# EAGLE schematic dev_kit_f103 (EAGLE 9.6.2)
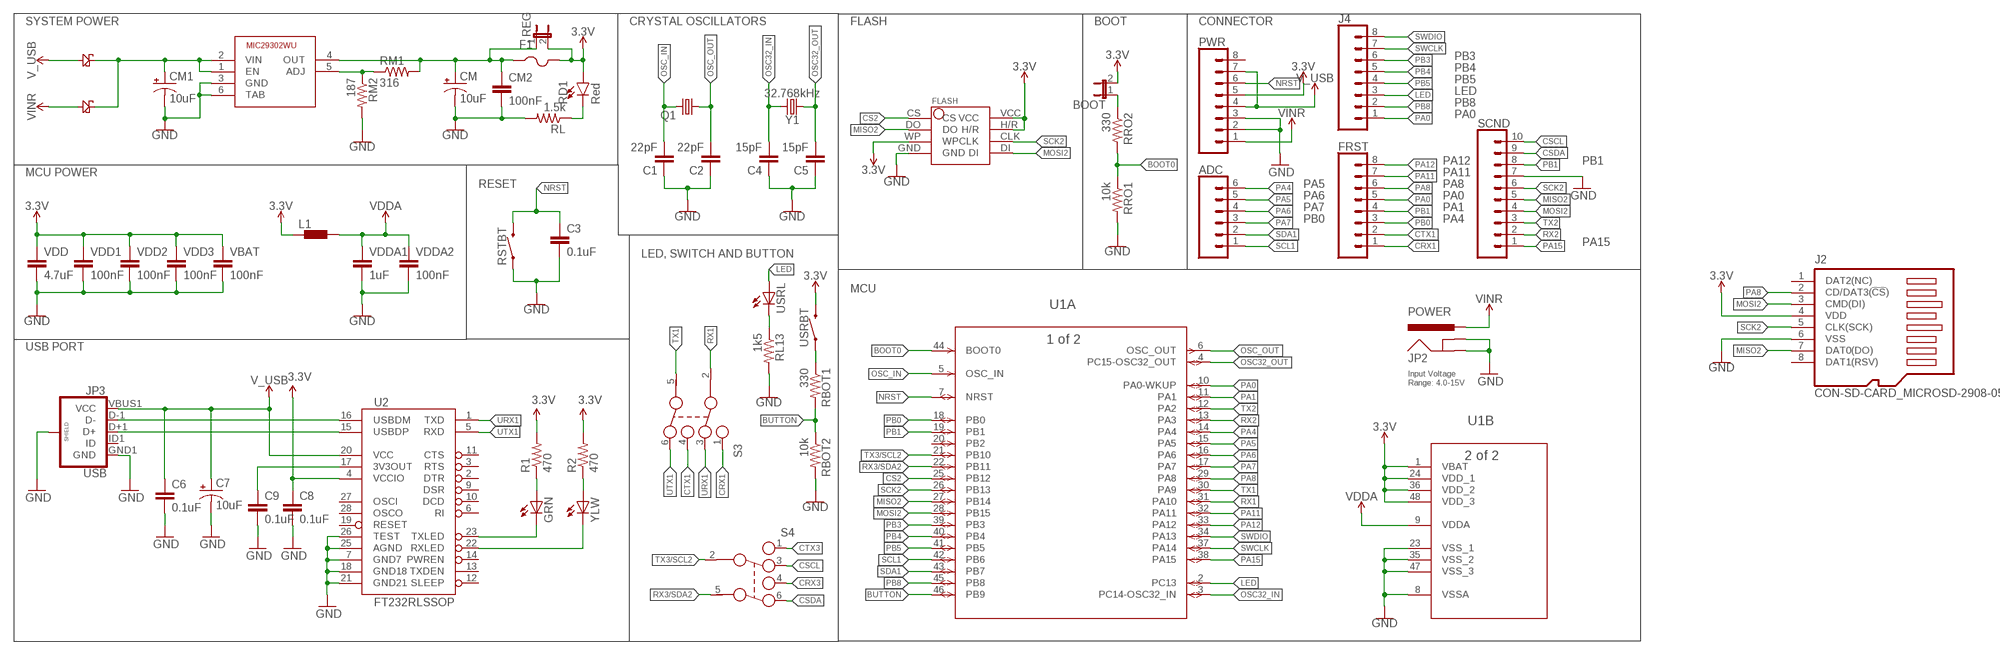
[diagram p0: schematic, sheet 1]

## Parts
ADC  CONN_06SILK_FEMALE_PTH  [1X06]
BOOT  JP1E  [JP1]
C1  22pF  22PF-0603-50V-5%  [0603]
C2  22pF  22PF-0603-50V-5%  [0603]
C3  0.1uF  22PF-0603-50V-5%  [0603]
C4  15pF  22PF-0603-50V-5%  [0603]
C5  15pF  22PF-0603-50V-5%  [0603]
C6  0.1uF  CAP0402-CAP  [0402-CAP]
C7  10uF  CAP_POL1206  [EIA3216]
C8  0.1uF  CAP0402-CAP  [0402-CAP]
C9  0.1uF  CAP0402-CAP  [0402-CAP]
CM  10uF  10UF-POLAR-EIA3528-20V-10%(TANT)  [EIA3528]
CM1  10uF  10UF-POLAR-EIA3528-20V-10%(TANT)  [EIA3528]
CM2  100nF  0.1UF-0603-25V-(+80/-20%)  [0603]
D1  3ASCHOOTKY  [3ASCHOOTKY]
D2  3ASCHOOTKY  [3ASCHOOTKY]
F1  PTCFUSE-1812  [1812]
FLASH  W25Q64  [W25Q64]
FRST  CONN_08"  [1X08]
GRN  LEDCHIP-LED0603  [CHIP-LED0603]
IC1  MIC29302WU  [TO263-5]
J2  CON-SD-CARD_MICROSD-2908-05  [CON-SD-CARD_2908-05]
J4  CONN_08"  [1X08]
JP2  POWER  POWER_JACKPTH_LOCK  [POWER_JACK_PTH_LOCK]
JP3  USB  USB_MICROB_PLUGCONN-11752  [USB-B-MICRO-SMD_V03]
L1  BLM15HB221SN1  [0402]
PWR  CONN_08"  [1X08]
Q1  CRYSTALHC49S  [HC49/S]
R1  470  RESISTOR0402-RES  [0402-RES]
R2  470  RESISTOR0402-RES  [0402-RES]
RBOT1  330  2.0KOHM1/10W5%(0603)  [0603-RES]
RBOT2  10k  2.0KOHM1/10W5%(0603)  [0603-RES]
RD1  Red  LED-RED0603-SMART  [LED-0603]
REG  JP1E  [JP1]
RL  1.5k  2.0KOHM1/10W5%(0603)  [0603-RES]
RL13  1k5  2.0KOHM1/10W5%(0603)  [0603-RES]
RM1  316  2.0KOHM1/10W5%(0603)  [0603-RES]
RM2  187  2.0KOHM1/10W5%(0603)  [0603-RES]
RRO1  10k  2.0KOHM1/10W5%(0603)  [0603-RES]
RRO2  330  2.0KOHM1/10W5%(0603)  [0603-RES]
RSTBT  MOMENTARY-SWITCH-SPST-SMD-6.0X3.5MM  [TACTILE_SWITCH_SMD_6.0X3.5MM]
S3  452403012014  [452403012014]
S4  452403012014  [452403012014]
SCND  CONN_10"  [1X10]
U1  STM32F103C8T6  [LQFP48-7X7MM]
U2  FT232RLSSOP  [SSOP28DB]
USRBT  MOMENTARY-SWITCH-SPST-SMD-6.0X3.5MM  [TACTILE_SWITCH_SMD_6.0X3.5MM]
USRL  LEDCHIP-LED0603  [CHIP-LED0603]
VBAT  100nF  0.1UF-0603-25V-(+80/-20%)  [0603]
VDD  4.7uF  0.1UF-0603-25V-(+80/-20%)  [0603]
VDD1  100nF  0.1UF-0603-25V-(+80/-20%)  [0603]
VDD2  100nF  0.1UF-0603-25V-(+80/-20%)  [0603]
VDD3  100nF  0.1UF-0603-25V-(+80/-20%)  [0603]
VDDA1  1uF  0.1UF-0603-25V-(+80/-20%)  [0603]
VDDA2  100nF  0.1UF-0603-25V-(+80/-20%)  [0603]
Y1  32.768kHz  CRYSTAL-32.768KHZPTH-2X6-KIT  [CRYSTAL-PTH-2X6-CYL-KIT]
YLW  LEDCHIP-LED0603  [CHIP-LED0603]

## Nets
3.3V: BOOT.2 F1.2 FLASH.H/R FLASH.VCC FLASH.WP J2.4(VDD) L1.1 PWR.5 RD1.A REG.2 U1.1(B:VBAT) U1.24(B:VDD_1) U1.36(B:VDD_2) U1.48(B:VDD_3) USRBT.2 VBAT.1 VDD1.1 VDD2.1 VDD3.1 VDD.1
BOOT0: RRO1.1 RRO2.2 U1.44(A:BOOT0)
BUTTON: RBOT1.2 RBOT2.1 U1.46(A:PB9)
CRX1: FRST.1 S3.1
CRX3: S4.4
CS2: FLASH.CS U1.25(A:PB12)
CSCL: S4.3 SCND.10
CSDA: S4.6 SCND.9
CTX1: FRST.2 S3.4
CTX3: S4.1
GND: C1.1 C2.1 C3.2 C4.1 C5.1 C6.2 C7.C(-) C8.2 C9.2 CM1.C(-) CM2.2 CM.C(-) FLASH.GND IC1.3(GND) IC1.6(TAB) J2.6(VSS) JP2.GND JP2.GNDBREAK JP3.GND1(GND) JP3.SHIELD1(SHIELD) JP3.SHIELD2(SHIELD) JP3.SHIELD3(SHIELD) PWR.2 PWR.3 RBOT2.2 RL13.2 RL.2 RM2.2 RRO1.2 RSTBT.1 SCND.7 U1.8(B:VSSA) U1.23(B:VSS_1) U1.35(B:VSS_2) U1.47(B:VSS_3) U2.7(GND7) U2.18(GND18) U2.21(GND21) U2.25(AGND) U2.26(TEST) VBAT.2 VDD1.2 VDD2.2 VDD3.2 VDD.2 VDDA1.2 VDDA2.2
LED: J4.3 U1.2(A:PC13) USRL.A
MISO2: FLASH.DO J2.7(DAT0(DO)) SCND.5 U1.27(A:PB14)
MOSI2: FLASH.DI J2.3(CMD(DI)) SCND.4 U1.28(A:PB15)
N$1: CM1.A(+) D1.OUT D2.OUT IC1.1(EN) IC1.2(VIN)
N$2: CM2.1 CM.A(+) F1.1 IC1.4(OUT) REG.1 RM1.2
N$3: BOOT.1 RRO2.1
N$4: RL13.1 USRL.C
N$5: RBOT1.1 USRBT.1
N$6: GRN.A R1.1
N$7: R2.1 YLW.A
N$8: C9.1 U2.17(3V3OUT)
N$20: IC1.5(ADJ) RM1.1 RM2.1
N$35: RD1.C RL.1
NRST: C3.1 PWR.6 RSTBT.2 U1.7(A:NRST)
OSC32_IN: C4.2 U1.3(A:PC14-OSC32_IN) Y1.2
OSC32_OUT: C5.2 U1.4(A:PC15-OSC32_OUT) Y1.1
OSC_IN: C1.2 Q1.2 U1.5(A:OSC_IN)
OSC_OUT: C2.2 Q1.1 U1.6(A:OSC_OUT)
PA0: FRST.5 J4.1 U1.10(A:PA0-WKUP)
PA1: U1.11(A:PA1)
PA4: ADC.6 U1.14(A:PA4)
PA5: ADC.5 U1.15(A:PA5)
PA6: ADC.4 U1.16(A:PA6)
PA7: ADC.3 U1.17(A:PA7)
PA8: FRST.6 J2.2(CD/DAT3(!CS!)) U1.29(A:PA8)
PA11: FRST.7 U1.32(A:PA11)
PA12: FRST.8 U1.33(A:PA12)
PA15: SCND.1 U1.38(A:PA15)
PB0: FRST.3 U1.18(A:PB0)
PB1: FRST.4 SCND.8 U1.19(A:PB1)
PB3: J4.6 U1.39(A:PB3)
PB4: J4.5 U1.40(A:PB4)
PB5: J4.4 U1.41(A:PB5)
PB8: J4.2 U1.45(A:PB8)
RX1: S3.2 U1.31(A:PA10)
RX2: SCND.2 U1.13(A:PA3)
RX3/SDA2: S4.5 U1.22(A:PB11)
RXLED: U2.22(RXLED) YLW.C
SCK2: FLASH.CLK J2.5(CLK(SCK)) SCND.6 U1.26(A:PB13)
SCL1: ADC.1 U1.42(A:PB6)
SDA1: ADC.2 U1.43(A:PB7)
SWCLK: J4.7 U1.37(A:PA14)
SWDIO: J4.8 U1.34(A:PA13)
TX1: S3.5 U1.30(A:PA9)
TX2: SCND.3 U1.12(A:PA2)
TX3/SCL2: S4.2 U1.21(A:PB10)
TXLED: GRN.C U2.23(TXLED)
URX1: S3.3 U2.1(TXD)
USB_D+: JP3.D+1(D+) U2.15(USBDP)
USB_D-: JP3.D-1(D-) U2.16(USBDM)
UTX1: S3.6 U2.5(RXD)
V_USB: C6.1 C7.A(+) D1.IN JP3.VBUS1(VCC) PWR.4 PWR.7 U2.20(VCC)
VCC: C8.1 R1.2 R2.2 U2.4(VCCIO) ; supply symbol labelled 3.3V
VDDA: L1.2 U1.9(B:VDDA) VDDA1.1 VDDA2.1
VIN: D2.IN JP2.PWR PWR.1 ; supply symbol labelled VINR
Unconnected: J2.1(DAT2(NC)) J2.8(DAT1(RSV)) J2.GND@1(GND) J2.GND@2(GND) J2.GND@3(GND) J2.GND@4(GND) JP3.ID1(ID) PWR.8 U1.20(A:PB2) U2.2(DTR) U2.3(RTS) U2.6(RI) U2.9(DSR) U2.10(DCD) U2.11(CTS) U2.12(SLEEP) U2.13(TXDEN) U2.14(PWREN) U2.19(RESET) U2.27(OSCI) U2.28(OSCO)

## Notes on the sheet
- SYSTEM POWER | CRYSTAL OSCILLATORS | FLASH | BOOT | CONNECTOR
- PB3
- PB4
- PB5
- LED
- PB8
- PA0
- PA12 | PB1
- MCU POWER | PA11
- RESET | PA5 | PA8
- PA6 | PA0
- PA7 | PA1
- PB0 | PA4
- PA15
- LED, SWITCH AND BUTTON
- MCU
- USB PORT
- Input Voltage
  Range: 4.0-15V

## Library data of the parts
ADC = SparkFun-Connectors:CONN_06: Multi connection point. Often used as Generic Header-pin footprint for 0.1 inch spaced/style header connections On any of the 0.1 inch spaced packages, you can populate with these: Break Away Headers - Straight <https://www.sparkfun.com/products/116> (PRT-00116) Break Away Male Headers - Right Angle <https://www.sparkfun.com/products/553> (PRT-00553) Female Headers <https://www.sparkfun.com/products/115> (PRT-00115) Break Away Headers - Machine Pin <https://www.sparkfun.com/products/117> (PRT-00117) Break Away Female Headers - Swiss Machine Pin <https://www.sparkfun.com/products/743> (PRT-00743) Arduino Stackable Header - 6 Pin <https://www.sparkfun.com/products/9280> (PRT-09280) For SCREWTERMINALS and SPRING TERMINALS visit here: Screw Terimnals on SparkFun.com <https://www.sparkfun.com/search/results?term=Screw+Terminals> (5mm/3.5mm/2.54mm spacing) This device is also useful as a general connection point to wire up your design to another part of your project. Our various solder wires solder well into these plated through hole pads. Hook-Up Wire - Assortment (Stranded, 22 AWG) <https://www.sparkfun.com/products/11375> (PRT-11375) Hook-Up Wire - Assortment (Solid Core, 22 AWG) <https://www.sparkfun.com/products/11367> (PRT-11367) View the entire wire category on our website here <https://www.sparkfun.com/categories/141>; PROD_ID: CONN-08437
BOOT REG = jumper:JP1E: JUMPER
C1 C2 = SparkFun-Capacitors:22PF: 22pF ceramic capacitors A capacitor is a passive two-terminal electrical component used to store electrical energy temporarily in an electric field.; PROD_ID: CAP-07876
C3-C5 = SparkFun-Capacitors:22PF: 22pF ceramic capacitors A capacitor is a passive two-terminal electrical component used to store electrical energy temporarily in an electric field.; PROD_ID: CAP-07876; VALUE: 22pF
C6 C8 C9 = SparkFun:CAP: Capacitor Standard 0603 ceramic capacitor, and 0.1" leaded capacitor.
C7 = SparkFun:CAP_POL: Capacitor Polarized These are standard SMD and PTH capacitors. Normally 10uF, 47uF, and 100uF in electrolytic and tantalum varieties. Always verify the external diameter of the through hole cap, it varies with capacity, voltage, and manufacturer. The EIA devices should be standard.
CM CM1 = SparkFun-Capacitors:10UF-POLAR: 10.0µF polarized capacitors A capacitor is a passive two-terminal electrical component used to store electrical energy temporarily in an electric field.; PROD_ID: CAP-08063
CM2 VBAT VDD VDD1-VDD3 VDDA1 VDDA2 = SparkFun-Capacitors:0.1UF: 0.1µF ceramic capacitors A capacitor is a passive two-terminal electrical component used to store electrical energy temporarily in an electric field.; PROD_ID: CAP-00810; VALUE: 0.1uF
D1 D2 = 1N4007:3ASCHOOTKY
F1 = adafruit:PTCFUSE: PTC fuses, resettable thermistors
FLASH = W25Q64:W25Q64
FRST J4 PWR = SparkFun-Connectors:CONN_08: Multi connection point. Often used as Generic Header-pin footprint for 0.1 inch spaced/style header connections On any of the 0.1 inch spaced packages, you can populate with these: Break Away Headers - Straight <https://www.sparkfun.com/products/116> (PRT-00116) Break Away Male Headers - Right Angle <https://www.sparkfun.com/products/553> (PRT-00553) Female Headers <https://www.sparkfun.com/products/115> (PRT-00115) Break Away Headers - Machine Pin <https://www.sparkfun.com/products/117> (PRT-00117) Break Away Female Headers - Swiss Machine Pin <https://www.sparkfun.com/products/743> (PRT-00743) Arduino Stackable Header - 8 Pin <https://www.sparkfun.com/products/9279> (PRT-09279) For SCREWTERMINALS and SPRING TERMINALS visit here: Screw Terimnals on SparkFun.com <https://www.sparkfun.com/search/results?term=Screw+Terminals> (5mm/3.5mm/2.54mm spacing) This device is also useful as a general connection point to wire up your design to another part of your project. Our various solder wires solder well into these plated through hole pads. Hook-Up Wire - Assortment (Stranded, 22 AWG) <https://www.sparkfun.com/products/11375> (PRT-11375) Hook-Up Wire - Assortment (Solid Core, 22 AWG) <https://www.sparkfun.com/products/11367> (PRT-11367) View the entire wire category on our website here <https://www.sparkfun.com/categories/141> Special notes: Molex polarized connector foot print use with SKU : PRT-08231 with associated crimp pins and housings. 1MM SMD Version SKU: PRT-10208 NOTES ON THE VARIANTS LOCK and LOCK_LONGPADS... This footprint was designed to help hold the alignment of a through-hole component (i.e. 6-pin header) while soldering it into place. You may notice that each hole has been shifted either up or down by 0.005 of an inch from it's more standard position (which is a perfectly straight line). This slight alteration caused the pins (the squares in the middle) to touch the edges of the holes. Because they are alternating, it causes a "brace" to hold the component in place. 0.005 has proven to be the perfect amount of "off-center" position when using our standard breakaway headers. Although looks a little odd when you look at the bare footprint, once you have a header in there, the alteration is very hard to notice. Also,if you push a header all the way into place, it is covered up entirely on the bottom side.; PROD_ID: CONN-08438
GRN USRL YLW = adafruit:LED: LED OSRAM: - CHIPLED LG R971, LG N971, LY N971, LG Q971, LY Q971, LO R971, LY R971 LH N974, LH R974 LS Q976, LO Q976, LY Q976 LO Q996 - Hyper CHIPLED LW Q18S LB Q993, LB Q99A, LB R99A - SideLED LS A670, LO A670, LY A670, LG A670, LP A670 LB A673, LV A673, LT A673, LW A673 LH A674 LY A675 LS A676, LA A676, LO A676, LY A676, LW A676 LS A679, LY A679, LG A679 - Hyper Micro SIDELED® LS Y876, LA Y876, LO Y876, LY Y876 LT Y87S - SmartLED LW L88C, LW L88S LB L89C, LB L89S, LG L890 LS L89K, LO L89K, LY L89K LS L896, LA L896, LO L896, LY L896 - TOPLED LS T670, LO T670, LY T670, LG T670, LP T670 LSG T670, LSP T670, LSY T670, LOP T670, LYG T670 LG T671, LOG T671, LSG T671 LB T673, LV T673, LT T673, LW T673 LH T674 LS T676, LA T676, LO T676, LY T676, LB T676, LH T676, LSB T676, LW T676 LB T67C, LV T67C, LT T67C, LS T67K, LO T67K, LY T67K, LW E67C LS E67B, LA E67B, LO E67B, LY E67B, LB E67C, LV E67C, LT E67C LW T67C LS T679, LY T679, LG T679 LS T770, LO T770, LY T770, LG T770, LP T770 LB T773, LV T773, LT T773, LW T773 LH T774 LS E675, LA E675, LY E675, LS T675 LS T776, LA T776, LO T776, LY T776, LB T776 LHGB T686 LT T68C, LB T68C - Hyper Mini TOPLED® LB M676 - Mini TOPLED Santana® LG M470 LS M47K, LO M47K, LY M47K Source: http://www.osram.convergy.de/
IC1 = MIC29302WU:MIC29302WU: Check prices <https://pricing.snapeda.com/parts/MIC29302WU/Microchip%20Technology/view-part?ref=eda>; AVAILABILITY: Good; DESCRIPTION: Linear Voltage Regulator IC Positive Adjustable 1 Output 3A TO-263-5; MF: Microchip Technology; MP: MIC29302WU; PACKAGE: TO-263-6 Microchip Technology; PRICE: None; PURCHASE-URL: https://pricing.snapeda.com/search/part/MIC29302WU/?ref=eda
J2 = 52101-101-REV-A_v16:CON-SD-CARD_MICROSD-: microSD Connector
JP2 = SparkFun-Connectors:POWER_JACK: Power Jack This is the standard 5.5mm barrel jack for power. The PTH is the most common, proven, reliable, footprint. The Slot footprint only works if the mill layer is transmitted to the PCB fab house so be warned. Mating wall wart : TOL-00298 (and others); PROD_ID: CONN-08197; SF_ID: PRT-00119
JP3 = SparkFun-Connectors:USB_MICROB_PLUG: USB Micro-B connectors Some male, some female. Watch your step!; PROD_ID: CONN-11752
L1 = inductors:BLM15H: EMIFIL (R) Chip Ferrite Bead for GHz Noise Source: http://www.murata.com/ Ferrite Bead BLM15H.pdf
Q1 = crystal:CRYSTAL: CRYSTAL; OC_FARNELL: 1667008; OC_NEWARK: unknown
R1 R2 = SparkFun:RESISTOR: Resistor Basic schematic elements and footprints for 0603, 1206, and PTH resistors.
RBOT1 RBOT2 RL RL13 RM1 RM2 RRO1 RRO2 = SparkFun-Resistors:2.0KOHM1/10W5%(0603): RES-08296; PROD_ID: RES-08296; VALUE: 2.0k
RD1 = SparkFun-LED:LED-RED: Red SMD LED Used in manufacturing of most products at SparkFun Packages: 0603 - SMD 0603 package [Product Link] <http://docs.avagotech.com/docs/AV02-0551EN> 0603 SMART - SMD 0603 SMART package ( more efficient and expensive)[Product Link] <http://www.osram-os.com/Graphics/XPic2/00077099_0.pdf> 1206 - SMD1206 package [Product Link] <https://www.sparkfun.com/datasheets/DevTools/LilyPad/Q150OVS4.pdff> SparkFun Products: Pro Mini 328 -5V <https://www.sparkfun.com/products/821> RedBoard <https://www.sparkfun.com/products/12757> IOIO-OTG <https://www.sparkfun.com/products/13613>; PROD_ID: DIO-11154
RSTBT USRBT = SparkFun-Switches:MOMENTARY-SWITCH-SPST: Momentary Switch (Pushbutton) - SPST Normally-open (NO) SPST momentary switches (buttons, pushbuttons). Variants PTH-12MM - 12mm square, through-hole Momentary Pushbutton Switch - 12mm Square <https://www.sparkfun.com/products/9190> (COM-09190) PTH-6.0MM, PTH-6.0MM-KIT - 6.0mm square, through-hole Mini Pushbutton Switch <https://www.sparkfun.com/products/97> (COM-00097) KIT package intended for soldering kit's - only one side of pads' copper is exposed. PTH-RIGHT-ANGLE-KIT - Right-angle, through-hole Right Angle Tactile Button <https://www.sparkfun.com/products/10791> - Used on SparkFun BigTime Watch Kit <https://www.sparkfun.com/products/11734> SMD-12MM - 12mm square, surface-mount Tactile Button - SMD (12mm) <https://www.sparkfun.com/products/12993> (COM-12993) Used on SparkFun PicoBoard <https://www.sparkfun.com/products/11888> SMD-4.5MM - 4.5mm Square Trackball Switch Used on SparkFun Blackberry Trackballer Breakout <https://www.sparkfun.com/products/13169> SMD-4.6MMX2.8MM - 4.60mm x 2.80mm, surface mount Used on SparkFun SAMD21 Mini Breakout <https://www.sparkfun.com/products/13664> SMD-5.2MM, SMD-5.2-REDUNDANT - 5.2mm square, surface-mount Mini Pushbutton Switch - SMD <https://www.sparkfun.com/products/8720> (COM-08720) Used on Arduino Pro Mini <https://www.sparkfun.com/products/11114> REDUNDANT package connects both switch circuits together SMD-6.0X3.5MM - 6.0 x 3.5mm, surface mount Momentary Reset Switch SMD <https://www.sparkfun.com/products/8229> (COM-08229) SMD-6.2MM-TALL - 6.2mm square, surface mount Tactile Button - SMD (6mm) <https://www.sparkfun.com/products/12992> Used on SparkFun Digital Sandbox <https://www.sparkfun.com/products/12651> SMD-RIGHT-ANGLE - Right-angle, surface mount Used on SparkFun Block for Intel® Edison - Arduino <https://www.sparkfun.com/products/13036>; PROD_ID: SWCH-00815; SF_SKU: COM-08229
S3 S4 = step_switch:452403012014: WS-SLSV Slide Switch, SMD version, same side connection Specification Rating : 300mA, 6VDC Contact Resistance Initial: 50mΩ max. After life test: 200mΩ max. Insulation Resistance: min.100MΩ at 500VDC Dielectric Strength : 500VAC for 1 minute Total-Travel : 2.0±0.2mm Operation Force :200 ±150g Life cycle : :20,000 steps Switch function :ON-ON Material Cover : : Stainless steel Base :PA9T UL 94 V-0, color Black. Actuator :LCP UL 94 V-0, color Black Contact : :Copper Alloy with Silver Terminal : Copper Alloy with Silver <http://katalog.we-online.de/media/images/v2/Family_WS-SLSV_452403012014.jpg> Details see: http://katalog.we-online.de/en/em/SLSV_7_65X_5_5_SMD_VERTICAL?sid=d553d9ab8e 2015 (C) Würth Elektronik
SCND = SparkFun-Connectors:CONN_10: Multi connection point. Often used as Generic Header-pin footprint for 0.1 inch spaced/style header connections On any of the 0.1 inch spaced packages, you can populate with these: Break Away Headers - Straight <https://www.sparkfun.com/products/116> (PRT-00116) Break Away Male Headers - Right Angle <https://www.sparkfun.com/products/553> (PRT-00553) Female Headers <https://www.sparkfun.com/products/115> (PRT-00115) Break Away Headers - Machine Pin <https://www.sparkfun.com/products/117> (PRT-00117) Break Away Female Headers - Swiss Machine Pin <https://www.sparkfun.com/products/743> (PRT-00743) Arduino Stackable Header - 10 Pin <https://www.sparkfun.com/products/11376> (PRT-11376) For SCREWTERMINALS and SPRING TERMINALS visit here: Screw Terimnals on SparkFun.com <https://www.sparkfun.com/search/results?term=Screw+Terminals> (5mm/3.5mm/2.54mm spacing) This device is also useful as a general connection point to wire up your design to another part of your project. Our various solder wires solder well into these plated through hole pads. Hook-Up Wire - Assortment (Stranded, 22 AWG) <https://www.sparkfun.com/products/11375> (PRT-11375) Hook-Up Wire - Assortment (Solid Core, 22 AWG) <https://www.sparkfun.com/products/11367> (PRT-11367) View the entire wire category on our website here <https://www.sparkfun.com/categories/141> Special notes: Molex polarized connector foot print use with SKU : PRT-08231 with associated crimp pins and housings. 1MM SMD Version SKU: PRT-10208 NOTES ON THE VARIANTS LOCK and LOCK_LONGPADS... This footprint was designed to help hold the alignment of a through-hole component (i.e. 6-pin header) while soldering it into place. You may notice that each hole has been shifted either up or down by 0.005 of an inch from it's more standard position (which is a perfectly straight line). This slight alteration caused the pins (the squares in the middle) to touch the edges of the holes. Because they are alternating, it causes a "brace" to hold the component in place. 0.005 has proven to be the perfect amount of "off-center" position when using our standard breakaway headers. Although looks a little odd when you look at the bare footprint, once you have a header in there, the alteration is very hard to notice. Also,if you push a header all the way into place, it is covered up entirely on the bottom side.; PROD_ID: CONN-11563
U1 = STM32F103C8T6:STM32F103C8T6; BUILT_BY: EMA_UL_Team; COPYRIGHT: Copyright (C) 2018 Accelerated Designs. All rights reserved; MANUFACTURER_PART_NUMBER: STM32F103C8T6; SOURCELIBRARY: Updates_to_database_2020-10-19; VENDOR: STMicroelectronics
U2 = SparkFun:FT232RL: USB UART FT232RL 4th Generation USB UART (USB <-> Serial) Controller. Spark Fun Electronics SKU : COM-00650
Y1 = SparkFun-Clocks:CRYSTAL-32.768KHZ: 32.768kHz Crystal Frequency: 32.768kHz Frequency Stability: ±20ppm Load Capacitance: 12.5pF (PTH-2X6 & SMD-3.2X1.5), 6pF (SMD-2X6) SparkFun Products: SparkFun BigTime Watch Kit <https://www.sparkfun.com/products/11734> SparkFun nRF52832 Breakout <https://www.sparkfun.com/products/13990> SparkFun Real Time Clock Module <https://www.sparkfun.com/products/12708>; PROD_ID: XTAL-10112

## Net classes
1 power: width 0.254 mm